# Altium schematic sheet infant_temperature_solar_power_1.SchDoc
size 431 x 279 mm
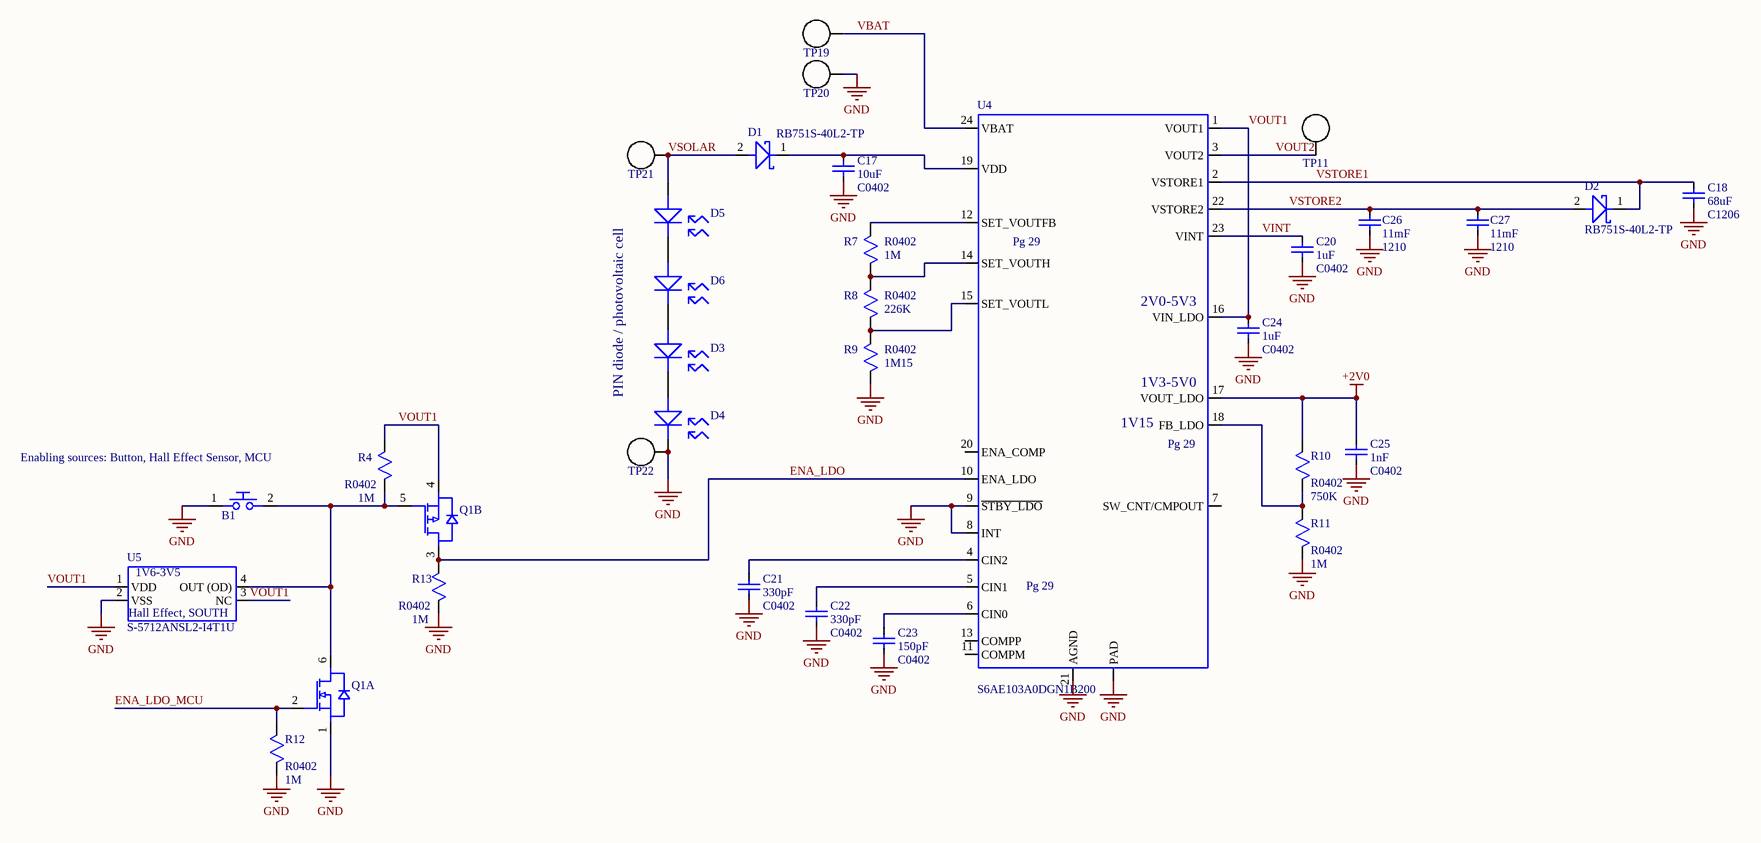
[diagram p0: infant_temperature_solar_power_1.SchDoc]

## Parts
B1  KXT331LHS  [KXT3_button]  (value not drawn)
C17  10uF  [C0402]
C18  68uF  [C1206]
C20  1uF  [C0402]
C21  330pF  [C0402]
C22  330pF  [C0402]
C23  150pF  [C0402]
C24  1uF  [C0402]
C25  1nF  [C0402]
C26  value 11mF  Package: 1210  [CPH3225A-2K]  (hidden comment: CPH3225A-2K)
C27  value 11mF  Package: 1210  [CPH3225A-2K]  (hidden comment: CPH3225A-2K)
D1  RB751S-40L2-TP  [D0402]
D2  RB751S-40L2-TP  [D0402]
D3  VEMD5060X01  [VEMD5060X01]  (value not drawn)
D4  VEMD5060X01  [VEMD5060X01]  (value not drawn)
D5  VEMD5060X01  [VEMD5060X01]  (value not drawn)
D6  VEMD5060X01  [VEMD5060X01]  (value not drawn)
Q1  dual fet SSMini6  [SSMini6-F3-B]  (value not drawn)  (parts A,B of 2)
R4  1M  [R0402]
R7  1M  [R0402]
R8  226K  [R0402]
R9  1M15  [R0402]
R10  750K  [R0402]
R11  1M  [R0402]
R12  1M  [R0402]
R13  1M  [R0402]
TP11  Not A Part  [TP_32AWG_1X0.5MM_ROUND]  (value not drawn)  (no BOM)
TP19  Not A Part  [TP_32AWG_1X0.5MM_ROUND]  (value not drawn)  (no BOM)
TP20  Not A Part  [TP_32AWG_1X0.5MM_ROUND]  (value not drawn)  (no BOM)
TP21  Not A Part  [TP_32AWG_1X0.5MM_ROUND]  (value not drawn)  (no BOM)
TP22  Not A Part  [TP_32AWG_1X0.5MM_ROUND]  (value not drawn)  (no BOM)
U4  MfgPartNumber: S6AE103A0DGN1B200  [VQFN-24_PAD]  (hidden comment: S6AE103A)
U5  S-5712ANSL2-I4T1U  [SNT-4A]

## Nets
+2V0: C25.1 R10.2 U4.17(VOUT_LDO)
GND: B1.1 C17.2 C18.2 C20.2 C21.2 C22.2 C23.2 C24.2 C25.2 C26.1 C27.1 D4.C Q1.1(S) R9.1 R11.1 R12.1 R13.1 TP20.1(MTG) TP22.1(MTG) U4.8(INT) U4.9(~{STBY_LDO}) U4.21(AGND) U4.PAD U5.2(VSS)
ENA_LDO: Q1.3(D) R13.2 U4.10(ENA_LDO)
ENA_LDO_MCU: Q1.2(G) R12.2
VBAT: TP19.1(MTG) U4.24(VBAT)
VINT: C20.1 U4.23(VINT)
VOUT1: C24.1 Q1.4(S) R4.2 U4.1(VOUT1) U4.16(VIN_LDO) U5.1(VDD) U5.3(NC)
VOUT2: TP11.1(MTG) U4.3(VOUT2)
VSOLAR: D1.2 D5.A TP21.1(MTG)
VSTORE1: C18.1 D2.1 U4.2(VSTORE1)
VSTORE2: C26.2 C27.2 D2.2 U4.22(VSTORE2)
NetB1_2: B1.2 Q1.5(G) Q1.6(D) R4.1 U5.4(OUT_(OD))
NetC17_1: C17.1 D1.1 U4.19(VDD)
NetC21_1: C21.1 U4.4(CIN2)
NetC22_1: C22.1 U4.5(CIN1)
NetC23_1: C23.1 U4.6(CIN0)
NetD3_A: D3.A D6.C
NetD3_C: D3.C D4.A
NetD5_C: D5.C D6.A
NetR7_1: R7.1 R8.2 U4.14(SET_VOUTH)
NetR7_2: R7.2 U4.12(SET_VOUTFB)
NetR8_1: R8.1 R9.2 U4.15(SET_VOUTL)
NetR10_1: R10.1 R11.2 U4.18(FB_LDO)

Not connected (* = marked no-connect by the designer): U4 7(SW_CNT/CMPOUT) 11(COMPM) 13(COMPP) 20(ENA_COMP)

## Notes on the sheet
- PIN diode / photovoltaic cell
- (near B1) Enabling sources: Button, Hall Effect Sensor, MCU
- (in symbol S6AE103A) Pg 29; 2V0-5V3; 1V3-5V0; 1V15
- (in symbol S-5712ANSL2-I4T1U) 1V6-3V5; Hall Effect, SOUTH

## Library data of the parts
B1 = KXT3_button: SWITCH TACTILE SPST-NO 0.02A 15V; Manufacturer: C&K; DigikeyPartNumber: CKN10779CT-ND; MfgPartNumber: KXT331LHS
C17 = CAP: Nonpolarized capacitor; Manufacturer: Murata; MfgPartNumber: GRJ155R60J106ME11D; VoltageRating: 6.3V; DigikeyPartNumber: 490-13211-1-ND; Value: 10uF; Package: C0402
C18 = CAP: Nonpolarized capacitor; Manufacturer: TDK Corporation; MfgPartNumber: C3216JB1A686M160AC; VoltageRating: 10V; DigikeyPartNumber: 445-11687-1-ND; Value: 68uF; Package: C1206
C20 C24 = CAP: Nonpolarized capacitor; Manufacturer: Taiyo Yuden; MfgPartNumber: TMK105BJ105MV-F; VoltageRating: 25V; DigikeyPartNumber: 587-3245-1-ND; Value: 1uF; Package: C0402
C21 C22 = CAP: Nonpolarized capacitor; Manufacturer: KEMET; MfgPartNumber: C0402C331J3GAC7867; VoltageRating: 25V; DigikeyPartNumber: 399-15320-1-ND; Value: 330pF; Package: C0402
C23 = CAP: Nonpolarized capacitor; Manufacturer: Murata; MfgPartNumber: GRM1555C1E151JA01D; VoltageRating: 25V; DigikeyPartNumber: 490-6171-1-ND; Value: 150pF; Package: C0402
C25 = CAP: Nonpolarized capacitor; Manufacturer: Yageo; MfgPartNumber: CC0402KRX7R8BB102; VoltageRating: 25V; DigikeyPartNumber: 311-1712-1-ND; Value: 1nF; Package: C0402
C26 C27 = CPH3225A-2K: 11mF (EDLC) Supercapacitor 3.3V 1210 (3225 Metric); Manufacturer: Seiko Instruments; DigikeyPartNumber: 728-1067-1-ND; MfgPartNumber: CPH3225A-2K; VoltageRating: 3.3V
D1 D2 = RB751S: Diode Schottky 40V 30mA Surface Mount DFN1006-2; Manufacturer: Micro Commercial Co; MfgPartNumber: RB751S-40L2-TP; DigikeyPartNumber: RB751S-40L2-TPMSCT-ND
D3-D6 = VEMD5060X01: PHOTODIODE PIN 820NM SMD; Manufacturer: Vishay; DigikeyPartNumber: VEMD5060X01CT-ND; MfgPartNumber: VEMD5060X01
Q1 = FG6943010R: MOSFET N/P-CH 30V 0.1A SSMINI6; Manufacturer: Panasonic Electronic Components; MfgPartNumber: FG6943010R; DigikeyPartNumber: FG6943010RCT-ND
R4 R7 R11-R13 = RES: Resistor; Manufacturer: Yageo; MfgPartNumber: RC0402FR-071ML; Tolerance: 1%; DigikeyPartNumber: 311-1.00MLRCT-ND; Value: 1M
R8 = RES: Resistor; Manufacturer: Yageo; MfgPartNumber: RC0402FR-07226KL; Tolerance: 1%; DigikeyPartNumber: 311-226KLRCT-ND; Value: 226K
R9 = RES: Resistor; Manufacturer: Vishay Dale; MfgPartNumber: CRCW04021M15FKED; Tolerance: 1%; DigikeyPartNumber: 541-1.15MLCT-ND; Value: 1M15
R10 = RES: Resistor; Manufacturer: Yageo; MfgPartNumber: AC0402FR-07750KL; Tolerance: 1%; DigikeyPartNumber: YAG5686CT-ND; Value: 750K
TP11 TP19-TP22 = TP_32AWG: 0.305mm (12mil) hole for 32AWG wire. No BOM item.
U4 = S6AE103A: IC PMIC ENERGY HARVESTING 24QFN; Manufacturer: Cypress; DigikeyPartNumber: 428-3873-1-ND
U5 = S-5712ANSL2-I4T1U: Digital Switch Unipolar Switch Open Drain Hall Effect SNT-4A; Manufacturer: ABLIC; DigikeyPartNumber: 1662-1617-1-ND; MfgPartNumber: S-5712ANSL2-I4T1U